# Altium schematic sheet Sheet_1_2025-10-18 (1).schdoc
size 147 x 83 mm
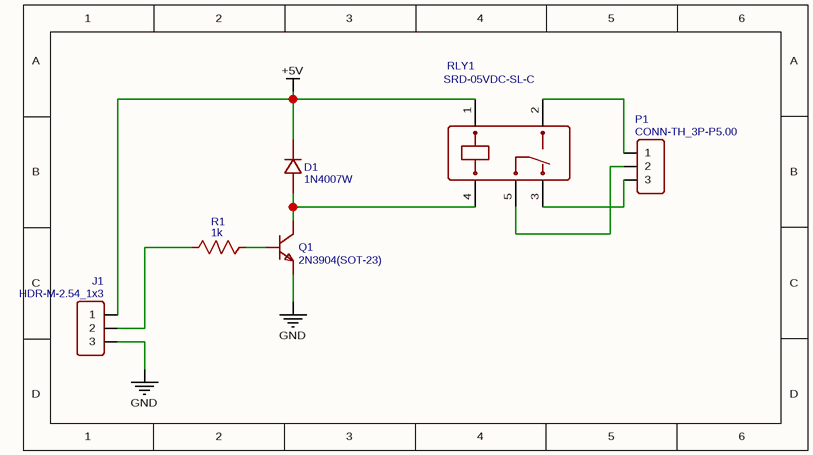
[diagram p0: Sheet_1_2025-10-18 (1).schdoc]

## Parts
D1  1N4007W  [SOD-123_L2.8-W1.8-LS3.7-RD]
J1  HDR-M-2.54_1x3  [HDR-M-2.54_1X3]
P1  CONN-TH_3P-P5.00  [CONN-TH_3P-P5.00]
Q1  2N3904(SOT-23)  [SOT-23-3_L2.9-W1.3-P1.90-LS2.4-TR]
R1  1k  [R1206]
RLY1  SRD-05VDC-SL-C  [RELAY-TH_SRD-XXVDC-XL-C]

## Nets
+5V: D1.1 J1.1 RLY1.1
GND: J1.3 Q1.1(E)
NetD1_2: D1.2 Q1.3(C) RLY1.4
NetJ1_2: J1.2 R1.1
NetP1_1: P1.1 RLY1.2
NetP1_2: P1.2 RLY1.5
NetP1_3: P1.3 RLY1.3
NetQ1_2: Q1.2(B) R1.2

## Library data of the parts
D1 = 1N4007W: Manufacturer: BLUE ROCKET; Contributor: LCEDA_Lib; Supplier: LCSC; Supplier Part: C328592; Manufacturer Part: 1N4007W; spicePre: D; spiceSymbolName: 1N4007W
J1 = HDR-M-2.54_1x3: Contributor: LCEDA_Lib; Supplier Part: C180248; Supplier: LCSC; spicePre: J; spiceSymbolName: HDR-M-2.54_1x3
P1 = CONN-TH_3P-P5.00: Contributor: LCEDA_Lib; Supplier: LCSC; spicePre: P; spiceSymbolName: CONN-TH_3P-P5.00
Q1 = 2N3904(SOT-23): Manufacturer: KEC; Manufacturer Part: 2n3904S-RTK/PS; Contributor: LCEDA_Lib; Supplier: LCSC; Supplier Part: C18536; Paste Type: SOT-23; spicePre: Q; spiceSymbolName: 2N3904(SOT-23)
R1 = 1k: nameAlias: Value(Ω); Contributor: LCEDA_Lib; spicePre: R; spiceSymbolName: R_1206_US
RLY1 = SRD-05VDC-SL-C: Manufacturer: 松乐; Supplier: LCSC; Manufacturer Part: SRD-05VDC-SL-C; Supplier Part: C35449; JLCPCB Part Class: Extended Part; link: https://lcsc.com/eda_search?q=C35449&%26type=1&ref=editor; spicePre: R; spiceSymbolName: SRD-05VDC-SL-C